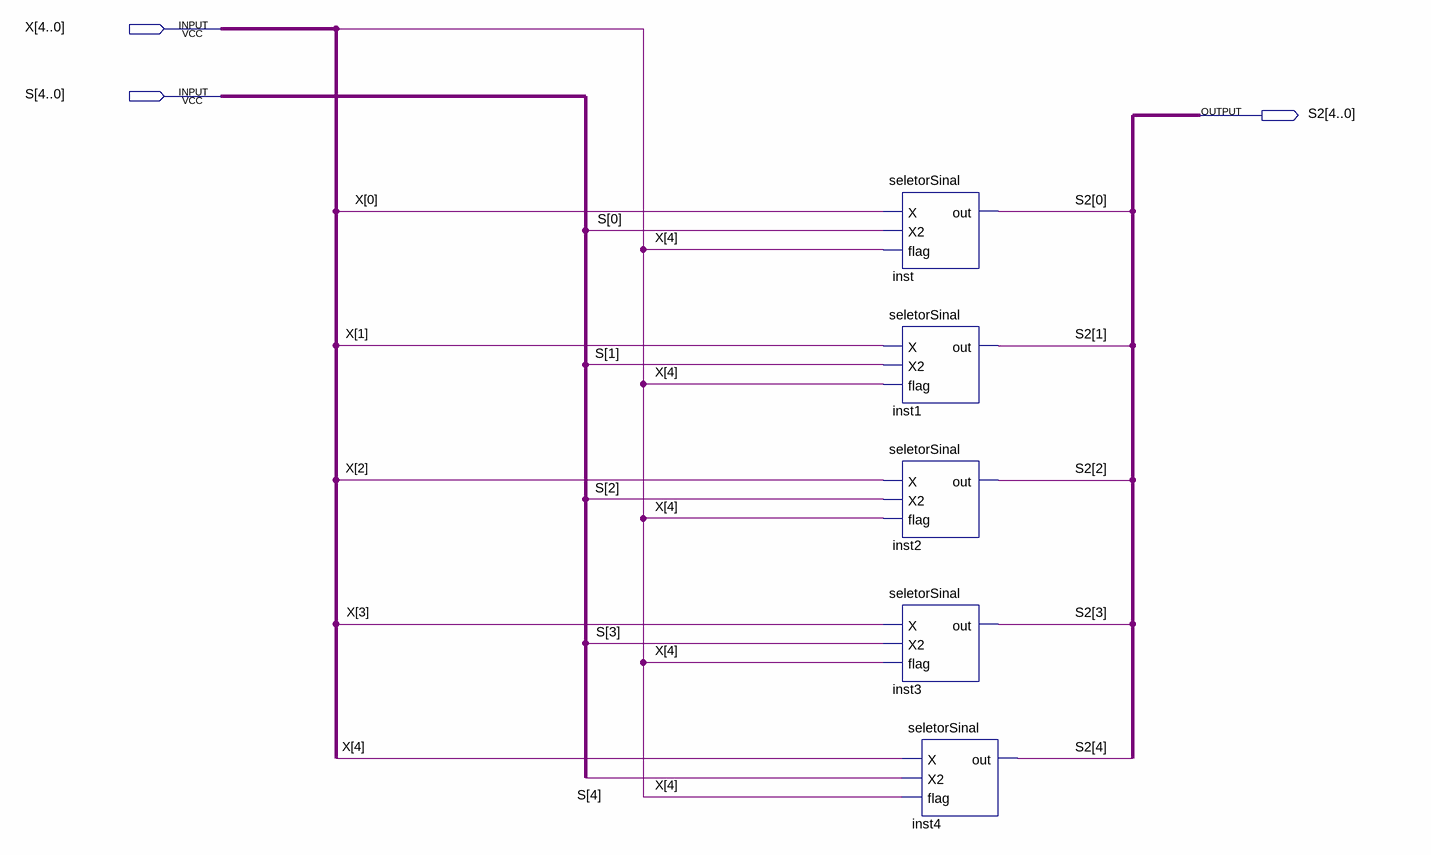
[diagram p0: schematic sheet]
// Quartus schematic VerificaSinal.bdf as structural Verilog: 5 symbols, 3 pins
module VerificaSinal (
  input  [4:0] X,
  input  [4:0] S,
  output [4:0] S2
);

  seletorSinal inst (.X(X[0]), .X2(S[0]), .flag(X[4]), .out(S2[0]));
  seletorSinal inst1 (.X(X[1]), .X2(S[1]), .flag(X[4]), .out(S2[1]));
  seletorSinal inst2 (.X(X[2]), .X2(S[2]), .flag(X[4]), .out(S2[2]));
  seletorSinal inst3 (.X(X[3]), .X2(S[3]), .flag(X[4]), .out(S2[3]));
  seletorSinal inst4 (.X(X[4]), .X2(S[4]), .flag(X[4]), .out(S2[4]));
endmodule
